# Altium schematic sheet ESP32 pico v3.SchDoc
size A4; SheetNumber: 3; SheetTotal: 5
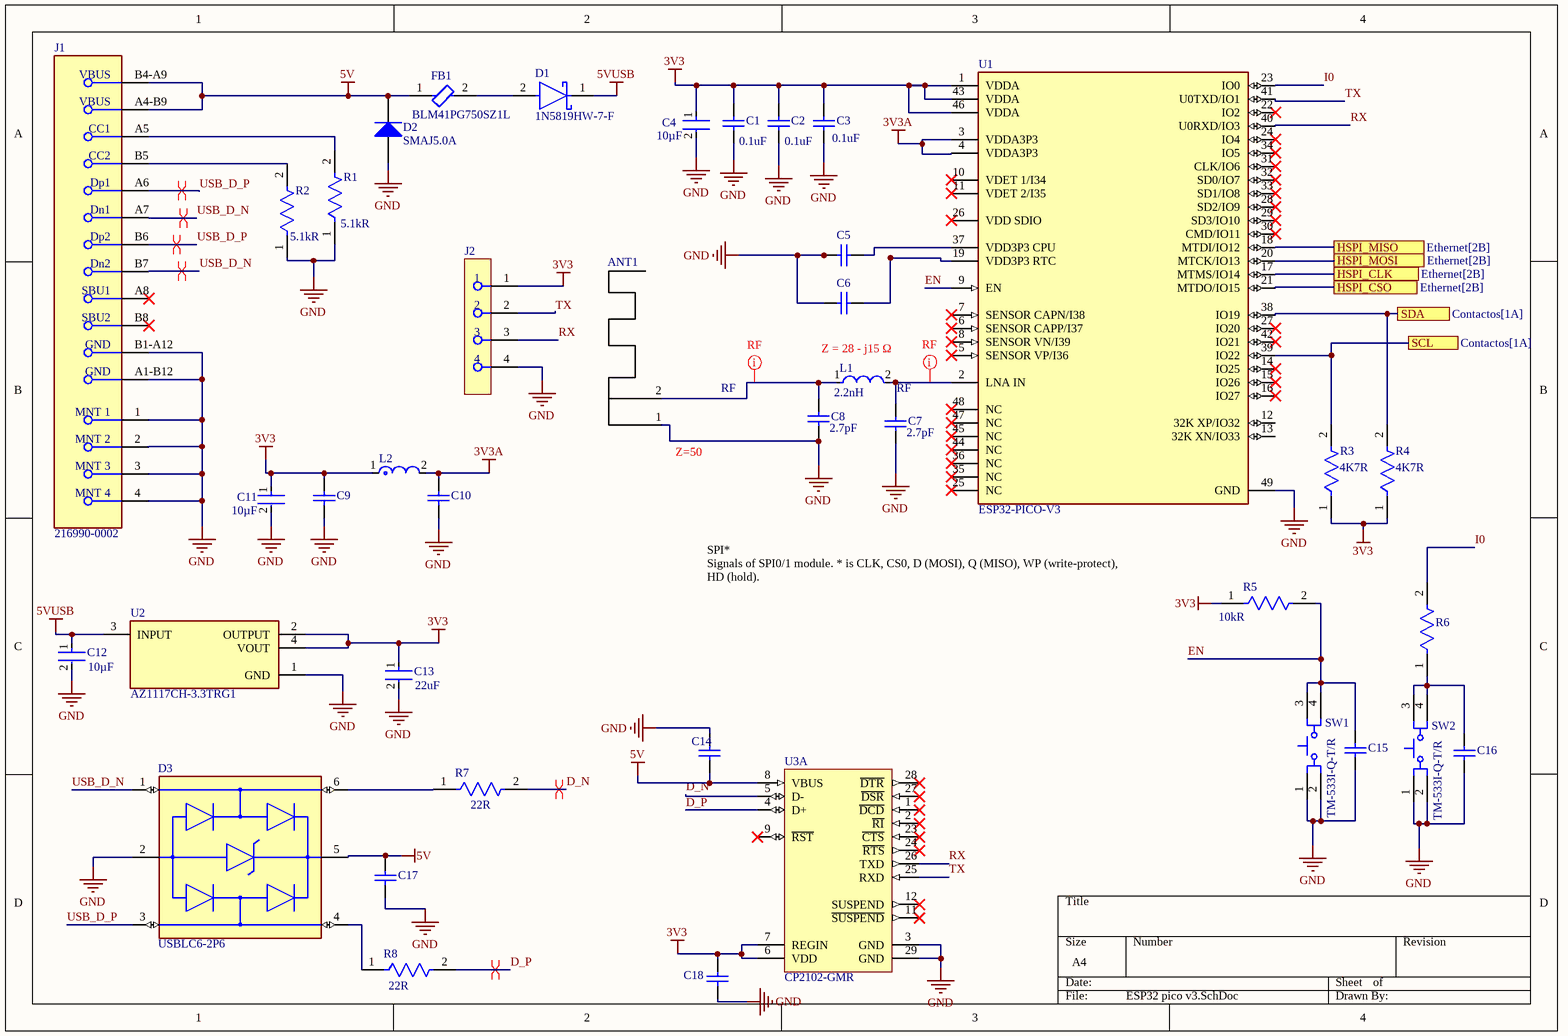
[diagram p0: ESP32 pico v3.SchDoc]

## Parts
ANT1  (no value)  [Antena 2.4Ghz]
C1  value 0.1uF  [CAPC1005X60X30ML05T10]  (hidden comment: C0402C104M9RACTU)
C2  value 0.1uF  [CAPC1005X60X30ML05T10]  (hidden comment: C0402C104M9RACTU)
C3  value 0.1uF  [CAPC1005X60X30ML05T10]  (hidden comment: C0402C104M9RACTU)
C4  Capacitance: 10µF  [FP-CC0603-DC-MFG]  (hidden comment: CC0603KRX5R7BB106)
C5  C0402C104M9RACTU  [CAPC1005X60X30ML05T10]  (value not drawn)
C6  C0402C104M9RACTU  [CAPC1005X60X30ML05T10]  (value not drawn)
C7  value 2.7pF  [CAPC0402(1005)60_N]  (hidden comment: CAP 2.7pF 50V 0402(1005))
C8  value 2.7pF  [CAPC0402(1005)60_N]  (hidden comment: CAP 2.7pF 50V 0402(1005))
C9  C0402C104M9RACTU  [CAPC1005X60X30ML05T10]  (value not drawn)
C10  C0402C104M9RACTU  [CAPC1005X60X30ML05T10]  (value not drawn)
C11  Capacitance: 10µF  [FP-CC0603-DC-MFG]  (hidden comment: CC0603KRX5R7BB106)
C12  Capacitance: 10µF  [FP-CC0603-DC-MFG]  (hidden comment: CC0603KRX5R7BB106)
C13  Capacitance: 22uF  [FP-C0805C226M8PACTU-IPC_A]  (hidden comment: C0805C226M8PACTU)
C14  C0402C104M9RACTU  [CAPC1005X60X30ML05T10]  (value not drawn)
C15  C0402C104M9RACTU  [CAPC1005X60X30ML05T10]  (value not drawn)
C16  C0402C104M9RACTU  [CAPC1005X60X30ML05T10]  (value not drawn)
C17  C0402C104M9RACTU  [CAPC1005X60X30ML05T10]  (value not drawn)
C18  C0402C104M9RACTU  [CAPC1005X60X30ML05T10]  (value not drawn)
D1  1N5819HW-7-F  [FP-SOD123-IPC_B]
D2  SMAJ5.0A  [BOUR-SMA-2_V]
D3  USBLC6-2P6  [FP-SOT-666-MFG]
FB1  BLM41PG750SZ1L  [FP-BLM41-0_2-a1_2-IPC_C]
J1  216990-0002  [FP-216990-0002-MFG]
J2  315-43-104-41-003000  [FP-315-43-104-41-003000-MFG]  (value not drawn)
L1  value 2.2nH  [FP-LQW18AN_10-MFG]  (hidden comment: LQW18AN2N2D1ZD)
L2  LQG15WZ22NH02J  [FP-LQG15WH_02-IPC_A]  (value not drawn)
R1  value 5.1kR  [FP-TFCR0603-IPC_A]  (hidden comment: TFCR0603-10W-E-5101FT-1K)
R2  value 5.1kR  [FP-TFCR0603-IPC_A]  (hidden comment: TFCR0603-10W-E-5101FT-1K)
R3  value 4K7R  [FP-TFCR0603-MFG]  (hidden comment: TFCR0603-10W-E-1001BT-1K)
R4  value 4K7R  [FP-TFCR0603-MFG]  (hidden comment: TFCR0603-10W-E-1001BT-1K)
R5  value 10kR  [FP-AC0603-IPC_B]  (hidden comment: AC0603FR-7W10KL)
R6  AC0603FR-7W10KL  [FP-AC0603-IPC_B]  (value not drawn)
R7  Resistance: 22R  [FP-RMCF0402-MFG]  (hidden comment: RMCF0402FT22R0)
R8  Resistance: 22R  [FP-RMCF0402-MFG]  (hidden comment: RMCF0402FT22R0)
SW1  TM-533I-Q-T/R  [MULT-TM-533I-Q_V]
SW2  TM-533I-Q-T/R  [MULT-TM-533I-Q_V]
U1  ESP32-PICO-V3  [FP-ESP32-PICO-V3-MFG]
U2  AZ1117CH-3.3TRG1  [FP-SOT223-MFG]
U3  CP2102-GMR  [SLAB-QFN-28-3125x3125TP_M]  (part A of 2)

## Ports
HSPI_CLK (see Ethernet[2B]), HSPI_CSO (see Ethernet[2B]), HSPI_MISO (see Ethernet[2B]), HSPI_MOSI (see Ethernet[2B]), SCL (see Contactos[1A]), SDA (see Contactos[1A])

## Nets
3V3: C1.2 C2.2 C3.2 C4.1 C9.2 C11.1 C13.1 C18.2 J2.1 L2.1 R3.1 R4.1 R5.1 U1.1(VDDA) U1.43(VDDA) U1.46(VDDA) U2.2(OUTPUT) U2.4(VOUT) U3.6(VDD) U3.7(REGIN)
3V3A: C10.2 L2.2 U1.3(VDDA3P3) U1.4(VDDA3P3)
5V: C14.1 C17.2 D2.2(K) D3.5(VBUS) FB1.1 J1.A4-B9(VBUS) J1.B4-A9(VBUS) U3.8(VBUS)
5VUSB: C12.1 D1.1(C) U2.3(INPUT)
GND: ANT1.1 C1.1 C2.1 C3.1 C4.2 C5.1 C6.1 C7.1 C8.1 C9.1 C10.1 C11.2 C12.2 C13.2 C14.2 C15.1 C16.1 C17.1 C18.1 D2.1(A) D3.2(GND) J1.1(MNT_1) J1.2(MNT_2) J1.3(MNT_3) J1.4(MNT_4) J1.A1-B12(GND) J1.B1-A12(GND) J2.4 R1.1 R2.1 SW1.1 SW1.2 SW2.1 SW2.2 U1.49(GND) U2.1(GND) U3.3(GND) U3.29(GND)
D_N: R7.2 U3.5(D-)
D_P: R8.2 U3.4(D+)
EN: C15.2 R5.2 SW1.3 SW1.4 U1.9(EN)
HSPI_CLK: U1.17(MTMS/IO14) ; port HSPI_CLK
HSPI_CSO: U1.21(MTDO/IO15) ; port HSPI_CSO
HSPI_MISO: U1.18(MTDI/IO12) ; port HSPI_MISO
HSPI_MOSI: U1.20(MTCK/IO13) ; port HSPI_MOSI
I0: R6.2 U1.23(IO0)
RX: J2.3 U1.40(U0RXD/IO3) U3.26(TXD)
SCL: R3.2 U1.39(IO22) ; port SCL
SDA: R4.2 U1.38(IO19) ; port SDA
TX: J2.2 U1.41(U0TXD/IO1) U3.25(RXD)
USB_D_N: D3.1(I/O1) J1.A7(Dn1) J1.B7(Dn2)
USB_D_P: D3.3(I/O2) J1.A6(Dp1) J1.B6(Dp2)
NetANT1_2: ANT1.2 C8.2 L1.1
NetC5_2: C5.2 U1.37(VDD3P3_CPU)
NetC6_2: C6.2 U1.19(VDD3P3_RTC)
NetC7_2: C7.2 L1.2 U1.2(LNA_IN)
NetC16_2: C16.2 R6.1 SW2.3 SW2.4
NetD1_2: D1.2(A) FB1.2
NetD3_4: D3.4(I/O2) R8.1
NetD3_6: D3.6(I/O1) R7.1
NetJ1_A5: J1.A5(CC1) R1.2
NetJ1_B5: J1.B5(CC2) R2.2

Not connected (* = marked no-connect by the designer): J1 A8(SBU1)* B8(SBU2)*; U1 5(SENSOR_VP/I36)* 6(SENSOR_CAPP/I37)* 7(SENSOR_CAPN/I38)* 8(SENSOR_VN/I39)* 10(VDET_1/I34)* 11(VDET_2/I35)* 12(32K_XP/IO32) 13(32K_XN/IO33) 14(IO25)* 15(IO26)* 16(IO27)* 22(IO2)* 24(IO4)* 25(NC)* 26(VDD_SDIO)* 27(IO20)* 28(SD2/IO9)* 29(SD3/IO10)* 30(CMD/IO11)* 31(CLK/IO6)* 32(SD0/IO7)* 33(SD1/IO8)* 34(IO5)* 35(NC)* 36(NC)* 42(IO21)* 44(NC)* 45(NC)* 47(NC)* 48(NC)*; U3 1(~{DCD})* 2(~{RI})* 9(~{RST})* 11(~{SUSPEND})* 12(SUSPEND)* 23(~{CTS})* 24(~{RTS})* 27(~{DSR})* 28(~{DTR})*

## Layout directives
differential pair: D_N, D_P, USB_D_N, USB_D_P
net class RF: NetANT1_2, NetC7_2

## Notes on the sheet
- Z = 28 - j15 Ω
- (near ANT1) Z=50
- (near U1) SPI*
  Signals of SPI0/1 module. * is CLK, CS0, D (MOSI), Q (MISO), WP (write-protect),
  HD (hold).

## Library data of the parts
ANT1 = Component_1: Design Item ID: Component_1; Source: antena2.4Ghz.SchLib
C1-C3 C5 C6 C9 C10 C14-C18 = CMP-2008-02199-1: Manufacturer: Kemet; Part Number: C0402C104M9RACTU
C4 C11 C12 = CMP-00621-81932632-1: CC0603KRX5R7BB106 Multilayer Ceramic Capacitor, 10 uF, 16 V, ± 10%, X5R, 0603 [1608 Metric]; Voltage Rating: 16V; NexarPartId: 81932632; Height: 1mm; Halogen Free: Halogen Free; Dielectric: X5R; Max Operating Temperature: 85°C; Voltage Rating (DC): 16V; Material: Ceramic; Lead Free: Lead Free; Tolerance: 10%; RoHS: Non-Compliant; Min Operating Temperature: -55°C; Case/Package: 0603
C7 C8 = CMP-1034-00215-1: CAP 2.7pF 50V ±0.1pF 0402 (1005 Metric) Thickness 0.6mm SMD; Case-Metric: 1005; Tolerance: Â±0.1pF; Case-EIA: 0402; Max Thickness: 0.6 mm; Rated Voltage: 50 V; Technology: SMT
C13 = CMP-03020-034697-1: CAP CER 22UF 10V X5R 0805; Tolerance: 20%; Dissipation Factor: 10%; Dielectric Material: Ceramic; Termination: Solder; Case Code (Imperial): 0805; Packaging: Tape and Reel; Height: 1.25mm; Voltage: 10V; Case Code (Metric): 2012; Case/Package: 0805; Width: 0.049inch; Length: 0.079inch; Depth: 1.25mm; RoHS Compliant: Yes; Voltage Rating (DC): 10V; Lead Free: Lead Free; Dielectric: X5R; Thickness: 0.055inch; Mount: Surface Mount; Voltage Rating: 10V; Max Operating Temperature: 85°C; Min Operating Temperature: -55°C
D1 = CMP-0303-00003-3: DIODE SCHOTTKY 40V 1A SOD123; Forward Voltage: 450mV; Capacitance: 110pF; Max Forward Surge Current (Ifsm): 25A; Peak Reverse Current: 50uA; Polarity: Standard; Element Configuration: Single; Max Power Dissipation: 450mW; Min Operating Temperature: -65°C; Package Quantity: 3000; Contact Plating: Tin; Weight: 0.000353oz; Max Repetitive Reverse Voltage (Vrrm): 40V; Max Reverse Voltage (DC): 40V; Height: 1.25mm; Average Rectified Current: 1A; Width: 1.7mm; Case/Package: SOD-123-2; Lead Free: Lead Free; Max Operating Temperature: 125°C; Current Rating: 1A; Termination: SMD/SMT; Forward Current: 1A; Radiation Hardening: No; Number of Pins: 2; Length: 2.85mm; Voltage Rating (DC): 40V; REACH SVHC: No SVHC; Peak Non-Repetitive Surge Current: 25A; Packaging: Tape and Reel; Output Current: 1A
D2 = CMP-2000-07090-1: SMAJ Transient Voltage Suppressor Diode Series, 3.5 V, -55 to 150 degC, 2-Pin SMA, RoHS, Tape and Reel; Manufacturer: Bourns; EDA / CAD Models: DownloadfromAcceleratedDesigns; Unidirectional Channels: 1; Voltage - Breakdown (Min): 6.4V; Voltage - Reverse Standoff (Typ): 5V; Voltage - Clamping (Max) @ Ipp: 9.2V; Other Names: SMAJ5.0ABDKR; Type: Zener; Catalog Drawings: SMAJSeriesFootprintSMAJ,SMBJSeries; Featured Product: SMAJ/SMBJ/SMCJ/SMLJDiscreteTVSDiodes; Power - Peak Pulse: 400W; Current - Peak Pulse (10/1000µs): 43.5A; Power Line Protection: No; Online Catalog: SMAJSeries; Supplier Device Package: SMA(DO-214AC); Operating Temperature: -55°C~150°C(TJ); Package Description: 2-Pin Surface Mount Device, Body 4.315 x 2.605 mm; Datasheet URL: https://datasheet.ciiva.com/25624/0900766b8112213b-25624680.pdf; Manufacturer URL: http://www.bourns.com/; Datasheet Version: 08/2012; Series: SMAJ; Family: TVS-Diodes; Bidirectional Channels: -; Applications: GeneralPurpose; Package Reference: SMA-2; Standard Package: 1; Package / Case: DO-214AC,SMA; Category: CircuitProtection; RoHS Information: SMAJSeriesMaterialDeclaration; Mounting Technology: SurfaceMount; Capacitance @ Frequency: -; Packaging: Digi-Reel®; Mounting Type: SurfaceMount
D3 = CMP-12225-000058-1: TVS DIODE 5.25V 17V SOT666; Min Breakdown Voltage: 6V; Power Line Protection: Yes; Element Configuration: Dual; Test Current: 1mA; Working Voltage: 5V; Number of Channels: 2; Max Reverse Leakage Current: 150nA; Direction: Unidirectional; Peak Pulse Current: 5A; Number of Elements: 1; Capacitance: 3.5pF; Max Breakdown Voltage: 6V; Height: 0.6mm; Depth: 1.3mm; Contact Plating: Tin; Reverse Breakdown Voltage: 6V; REACH SVHC: No SVHC; Operating Supply Voltage: 5V; Width: 1.3mm; Max Operating Temperature: 125°C; Reverse Standoff Voltage: 5V; ESD Protection: Yes; Package Quantity: 1; Termination: SMD/SMT; Length: 1.7mm; Leakage Current: 150nA; Number of Bidirectional Channels: 2; Case/Package: SOT-666; Min Operating Temperature: -40°C; Number of Pins: 6; Clamping Voltage: 17V; Breakdown Voltage: 6V; Lead Free: Lead Free; Radiation Hardening: No; Packaging: Tape and Reel; Mount: Surface Mount; Polarity: Unidirectional
FB1 = CMP-06046-001990-1: Ferrite Bead, 1806, 75Ω @ 100MHz, 0.015Ω, 3.5A; RoHS Compliant: Yes
J1 = CMP-04767-000018-1: CONN RCP USB2.0 TYP C 24P SMD RA
J2 = CMP-00254-30991456-1: 315-43-104-41-003000 4 Position Receptacle Connector 0.100 (2.54mm) Through Hole Gold"; Number of Contacts: 4; Current Rating: 3A; Voltage Rating: 150V; Connector Type: Receptacle, Socket; Color: Black; Contact Material: Gold, Nickel; Contact Plating: Gold; Mount: Through Hole; RoHS: Compliant; Pitch: 2.54mm; Packaging: Bulk; Height: 2.667mm; Number of Positions: 4; Max Operating Temperature: 125°C; Min Operating Temperature: -55°C; Number of Rows: 1; Termination: Solder
L1 = CMP-06042-001078-1: Wire Wound RF Inductor for Automotive 2.2nH ±0.5nH 1400mA 0.018Ω 0603 (1608)
L2 = CMP-06042-013847-1: Multilayer type Inductor for Automotive 22nH ±3% 1.1Ω 230mA 0402
R1 R2 = CMP-250906-189493-1: RES Thin Film,  5.1kΩ, 1%, 0.1W, 25ppm/°C, 0603
R3 R4 = CMP-250906-149963-1: RES Thin Film,  1kΩ, 0.1%, 0.1W, 25ppm/°C, 0603
R5 R6 = CMP-03412-038553-1: RES 10kΩ 1.00% 0.2W 0603
R7 R8 = CMP-26527-006952-1: 22Ω ±1% 0.063W 0402 Thick Film Chip Resistor AEC-Q200 compliant; Temperature Coefficient: 100ppm/°C; Max Power Dissipation: 63mW; RoHS Compliant: Yes; Min Operating Temperature: -55°C; Features: Automotive AEC-Q200; Max Operating Temperature: 155°C; Number of Terminations: 2; Length: 0.039inch; Height: 0.016inch; Tolerance: 1%; Packaging: Tape and Reel; Width: 0.02inch; Resistor Type: Thick Film; Contact Plating: Tin; Case/Package: 0402; Series: RMCF; Mount: Surface Mount
SW1 SW2 = CMP-1762-00001-1: TACT Switch, SPNO, -25 to 70 degC, 4-Pin SMD, RoHS, Tape and Reel; PackageDescription: 4-Pin Surface Mount Device, Body 5.2 x 5.2 mm; PackageReference: TM-533I-Q-T/R; DatasheetVersion: Rev. 1.1, 12/2011; ComponentLink1Description: Datasheet; ComponentLink1URL: http://www.micropik.com/PDF/pul5x5.pdf
U1 = CMP-194065-000030-1: RX TXRX MOD WIFI SURFACE MOUNT
U2 = CMP-12756-000028-1: IC REG LINEAR 3.3V 800MA SOT223; Accuracy: 1%; Reference Voltage: 1.262V; Quiescent Current: 6mA; Power Supply Rejection Ratio (PSRR): 70dB; Max Input Voltage: 15V; Max Output Current: 1.35A; Output Type: Fixed; Min Current Limit: 1A; Number of Regulators: 1; Polarity: Positive; Dropout Voltage: 1.2V; Output Current: 800mA; Width: 3.7mm; Case/Package: SOT-223; Length: 6.7mm; Mount: Surface Mount; Output Voltage: 3.3V; Lead Free: Lead Free; Min Operating Temperature: -20°C; Packaging: Tape and Reel; Package Quantity: 4000; Max Operating Temperature: 125°C; Number of Pins: 4; Number of Outputs: 1; Height: 1.7mm
U3 = CMP-2000-04924-1: Single-Chip USB to URAT Bridge, 3.3 V, -40 to 85 degC, 28-Pin QFN, RoHS, Tape and Reel; Manufacturer: Silicon Labs; Interface Circuit Standard 1: RS-232; Transmitter and Receiver FIFO Counter: No; Supply Current: 26mA; Operating Supply Voltage (Min): 3V; Operating Supply Voltage (Typ): 3.3V; Data Rate: 1000kbps; Operating Supply Voltage (Max): 3.6V; Number of Channels: 1; Package URL: http://www.silabs.com/Support%20Documents/TechnicalDocs/C8051T61x.pdf; Operating Temperature (Max): 85C; Datasheet URL: http://www.mouser.com/ds/2/368/CP2102-9-247052.pdf; Operating Temperature Classification: Industrial; Operating Temperature (Min): -40C; Package Description: 28-Pin Quad-Flat No-Leads Package, Body 5 x 5 mm, Pitch 0.5 mm; Manufacturer URL: http://www.silabs.com/; Rad Hardened: No; Package Reference: QFN-28; Pin Count: 28; Packaging: TapeandReel; Mounting: SurfaceMount; Package Type: QFNEP; Datasheet Version: Rev. 1.6, 12/2013